# Altium schematic sheet Power.SchDoc
size A3
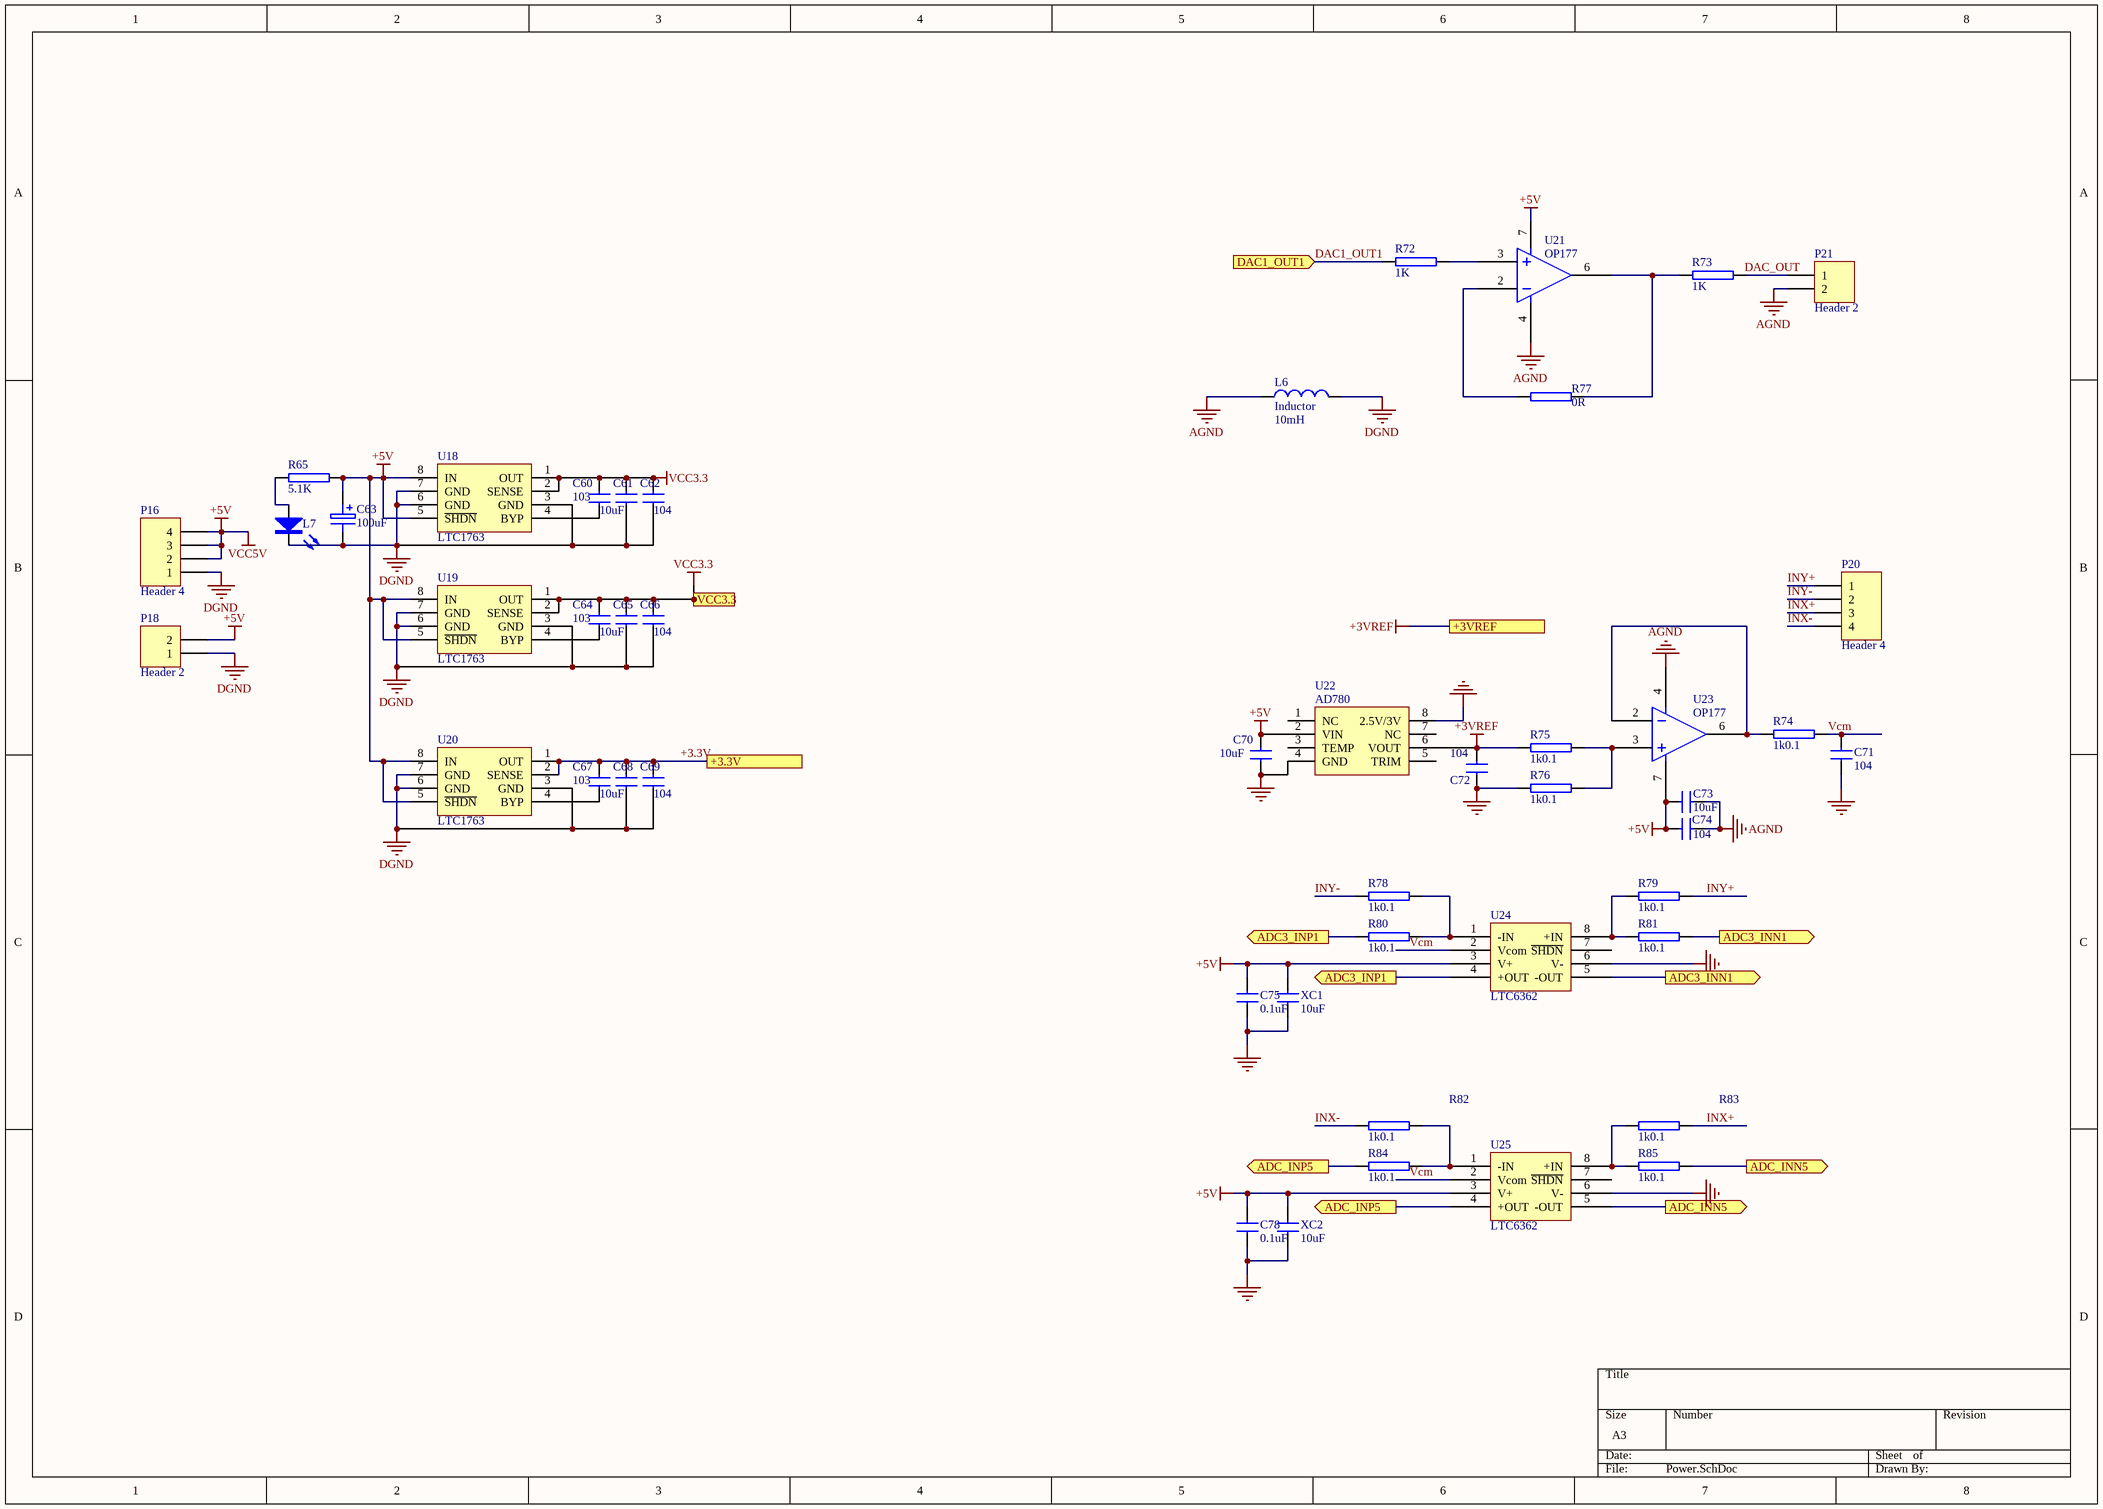
[diagram p0: Power.SchDoc]

## Parts
C60  103  [0603]
C61  10uF  [0603]
C62  104  [0603]
C63  100uF  [100UF/25V_CA]
C64  103  [0603]
C65  10uF  [0603]
C66  104  [0603]
C67  103  [0603]
C68  10uF  [0603]
C69  104  [0603]
C70  10uF  [0603]
C71  104  [0603]
C72  104  [0603]
C73  10uF  [0603]
C74  104  [0603]
C75  0.1uF  [0603]
C78  0.1uF  [0603]
L6  Inductor  value 10mH  [0805]
L7  LED  [0805LED]  (value not drawn)
P16  Header 4  [HDR1X4]
P18  Header 2  [HDR1X2]
P20  Header 4  [HDR1X4]
P21  Header 2  [HDR1X2]
R65  5.1K  [0603]
R72  1K  [0603]
R73  1K  [0603]
R74  1k0.1  [0603]
R75  1k0.1  [0603]
R76  1k0.1  [0603]
R77  0R  [0603]
R78  1k0.1  [0603]
R79  1k0.1  [0603]
R80  1k0.1  [0603]
R81  1k0.1  [0603]
R82  1k0.1  [0603]
R83  1k0.1  [0603]
R84  1k0.1  [0603]
R85  1k0.1  [0603]
U18  LTC1763  [SO-8]
U19  LTC1763  [SO-8]
U20  LTC1763  [SO-8]
U21  OP177  [SO-8]
U22  AD780  [SO-8]
U23  OP177  [SO-8]
U24  LTC6362  [LT6350XIN]
U25  LTC6362  [LT6350XIN]
XC1  10uF  [0603]
XC2  10uF  [0603]

## Ports
+3.3V, +3VREF, ADC3_INN1 (out), ADC3_INP1 (out), ADC_INN5 (out), ADC_INP5 (out), DAC1_OUT1 (in), VCC3.3

## Nets
+3VREF: C72.2 R75.1 U22.6(VOUT) ; port +3VREF
+5V: C63.1 C70.1 C73.2 C74.2 C75.2 C78.2 P16.2 P16.3 P16.4 P18.2 R65.1 U18.5(~{SHDN}) U18.8(IN) U19.5(~{SHDN}) U19.8(IN) U20.5(~{SHDN}) U20.8(IN) U21.7 U22.2(VIN) U23.7 U24.3(V+) U25.3(V+) XC1.1 XC2.1  [also labelled VCC5V]
AGND: C70.2 C71.2 C72.1 C73.1 C74.1 C75.1 C78.1 L6.1 P21.2 R76.1 U21.4 U22.4(GND) U22.8(2.5V/3V) U23.4 U24.6(V-) U25.6(V-) XC1.2 XC2.2
DGND: C61.2 C62.2 C63.2 C65.2 C66.2 C68.2 C69.2 L6.2 L7.2(K) P16.1 P18.1 U18.3(GND) U18.6(GND) U18.7(GND) U19.3(GND) U19.6(GND) U19.7(GND) U20.3(GND) U20.6(GND) U20.7(GND)
VCC3.3: C60.1 C61.1 C62.1 C64.1 C65.1 C66.1 U18.1(OUT) U18.2(SENSE) U19.1(OUT) U19.2(SENSE) ; port VCC3.3
+3.3V: C67.1 C68.1 C69.1 U20.1(OUT) U20.2(SENSE) ; port +3.3V
ADC3_INN1: R81.2 U24.5(-OUT) ; port ADC3_INN1
ADC3_INP1: R80.1 U24.4(+OUT) ; port ADC3_INP1
ADC_INN5: R85.2 U25.5(-OUT) ; port ADC_INN5
ADC_INP5: R84.1 U25.4(+OUT) ; port ADC_INP5
DAC1_OUT1: R72.2 ; port DAC1_OUT1
INX+: P20.3 R83.2
INX-: P20.4 R82.2
INY+: P20.1 R79.2
INY-: P20.2 R78.2
Vcm: C71.1 R74.2 U24.2(Vcom) U25.2(Vcom)
NetC60_2: C60.2 U18.4(BYP)
NetC64_2: C64.2 U19.4(BYP)
NetC67_2: C67.2 U20.4(BYP)
NetL7_1: L7.1(A) R65.2
NetP21_1: P21.1 R73.1
NetR72_1: R72.1 U21.3
NetR73_2: R73.2 R77.1 U21.6
NetR74_1: R74.1 U23.2 U23.6
NetR75_2: R75.2 R76.2 U23.3
NetR77_2: R77.2 U21.2
NetR78_1: R78.1 R80.2 U24.1(-IN)
NetR79_1: R79.1 R81.1 U24.8(+IN)
NetR82_1: R82.1 R84.2 U25.1(-IN)
NetR83_1: R83.1 R85.1 U25.8(+IN)

Not connected (* = marked no-connect by the designer): U22 1(NC) 3(TEMP) 5(TRIM) 7(NC); U24 7(~{SHDN}); U25 7(~{SHDN})

## Notes on the sheet
- Labels drawn without touching a wire or pin: DAC_OUT

## Library data of the parts
C60-C62 C64-C75 C78 XC1 XC2 = C
C63 = ELECTRO1
L6 = Inductor: Code_IEC: 1005; Published: 8-Jun-2000; LatestRevisionDate: 29-May-2009; LatestRevisionNote: IPC-7351 Footprint Added.; PackageReference: 0402-A; Publisher: Altium Limited; PackageDescription: Chip Inductor; Code_JEITA: 0402
P16 P20 = Header 4: Header, 4-Pin; LatestRevisionDate: 17-Jul-2002; LatestRevisionNote: Re-released for DXP Platform.; Publisher: Altium Limited
P18 P21 = Header 2: Header, 2-Pin; LatestRevisionDate: 17-Jul-2002; LatestRevisionNote: Re-released for DXP Platform.; Publisher: Altium Limited
R65 R72-R85 = RES
U18-U20 = LT1763
U21 U23 = LM207
U24 U25 = LTC6362: SAR ADC Drive